# EAGLE design plansza_do_teleturnieju (EAGLE 9.6.2)
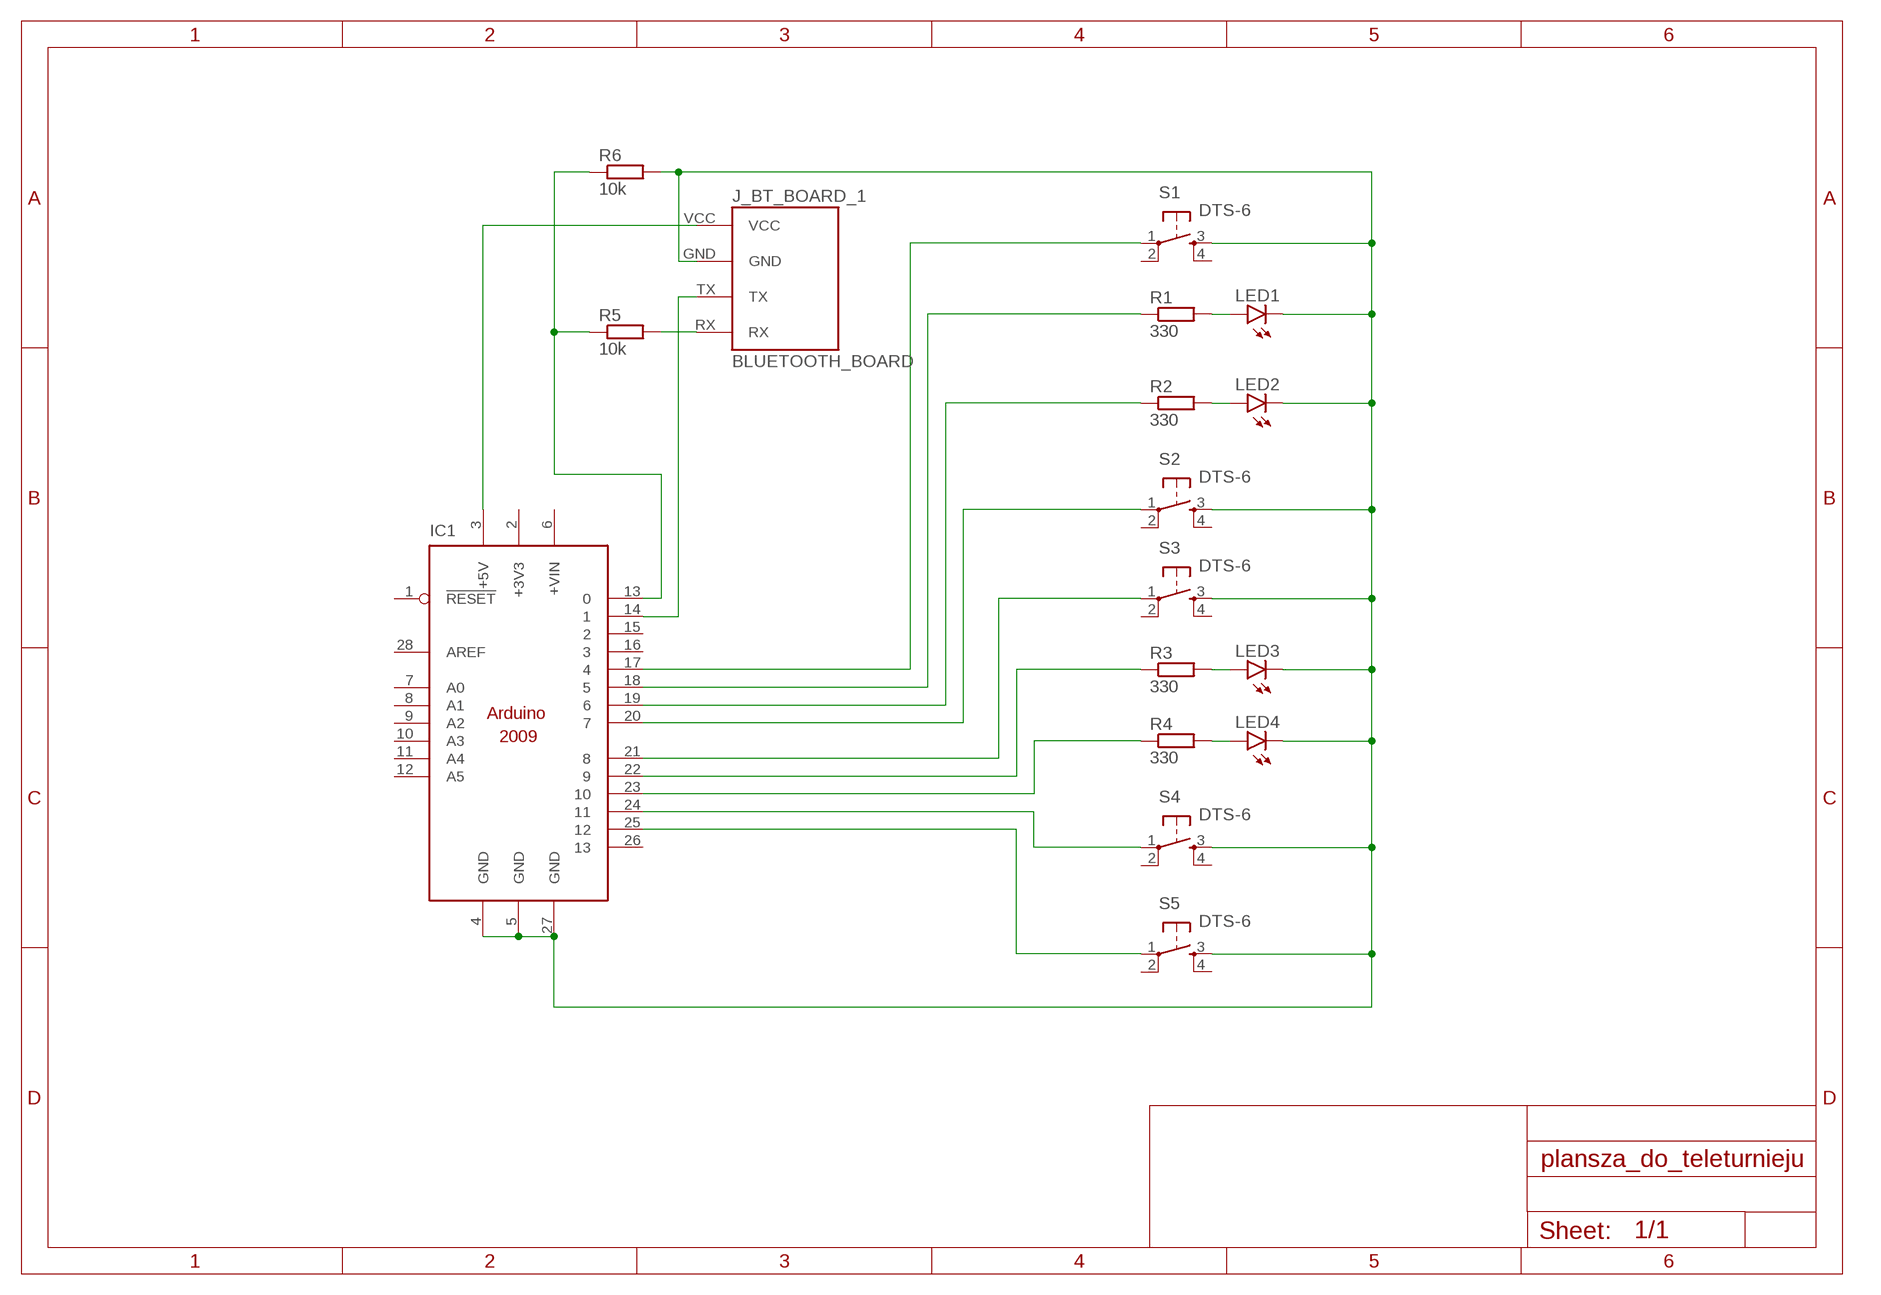
[diagram p0: schematic, sheet 1]

## Parts
IC1  ARDUINO2009_10  [ARDUINO2009]
J_BT_BOARD_1  BLUETOOTH_BOARD  [BT_BOARD_FOOTPRINT]
LED1  LEDLD260  [LD260]
LED2  LEDLD260  [LD260]
LED3  LEDLD260  [LD260]
LED4  LEDLD260  [LD260]
R1  330  R-EU_0204/7  [0204/7]
R2  330  R-EU_0204/7  [0204/7]
R3  330  R-EU_0204/7  [0204/7]
R4  330  R-EU_0204/7  [0204/7]
R5  10k  R-EU_0204/7  [0204/7]
R6  10k  R-EU_0204/7  [0204/7]
S1  DTS-6  [DTS-6]
S2  DTS-6  [DTS-6]
S3  DTS-6  [DTS-6]
S4  DTS-6  [DTS-6]
S5  DTS-6  [DTS-6]

## Nets
N$1: IC1.17 S1.1
N$2: IC1.18 R1.1
N$3: IC1.24 S4.1
N$4: IC1.23 R4.1
N$5: IC1.21 S3.1
N$6: IC1.22 R3.1
N$7: IC1.20 S2.1
N$8: IC1.19 R2.1
N$9: IC1.4(GND) IC1.5(GND) IC1.27(GND) J_BT_BOARD_1.GND LED1.K(C) LED2.K(C) LED3.K(C) LED4.K(C) R6.2 S1.3 S2.3 S3.3 S4.3 S5.3
N$10: IC1.25 S5.1
N$11: LED1.A R1.2
N$12: IC1.3(+5V) J_BT_BOARD_1.VCC
N$13: IC1.13 R5.1 R6.1
N$14: J_BT_BOARD_1.RX R5.2
N$15: LED2.A R2.2
N$16: LED3.A R3.2
N$17: LED4.A R4.2
N$18: IC1.14 J_BT_BOARD_1.TX
Unconnected: IC1.1(!RESET) IC1.6(+VIN) IC1.7(A0) IC1.8(A1) IC1.9(A2) IC1.10(A3) IC1.11(A4) IC1.12(A5) IC1.15 IC1.16 IC1.26 IC1.28(AREF) S1.2 S1.4 S2.2 S2.4 S3.2 S3.4 S4.2 S4.4 S5.2 S5.4

## Power pins joined to a net without a drawn wire
+3V3: IC1.2(+3V3)

## Library data of the parts
IC1 = jn:ARDUINO2009_1: The Arduino Duemilanove ("2009") is a microcontroller board based on the ATmega168 or ATmega328. - 14 digital input/output pins (of which 6 can be used as PWM outputs) - 6 analog inputs, a 16 MHz crystal oscillator - USB connection - power jack - ISP header - reset button It contains everything needed to support the microcontroller; simply connect it to a computer with a USB cable or power it with a AC-to-DC adapter or battery to get started http://arduino.cc/en/Main/ArduinoBoardDuemilanove
J_BT_BOARD_1 = jn:BLUETOOTH_BOARD: Bluetooth Board V1.05
LED1-LED4 = jn:LED: LED OSRAM: - CHIPLED LG R971, LG N971, LY N971, LG Q971, LY Q971, LO R971, LY R971 LH N974, LH R974 LS Q976, LO Q976, LY Q976 LO Q996 - Hyper CHIPLED LW Q18S LB Q993, LB Q99A, LB R99A - SideLED LS A670, LO A670, LY A670, LG A670, LP A670 LB A673, LV A673, LT A673, LW A673 LH A674 LY A675 LS A676, LA A676, LO A676, LY A676, LW A676 LS A679, LY A679, LG A679 - Hyper Micro SIDELED® LS Y876, LA Y876, LO Y876, LY Y876 LT Y87S - SmartLED LW L88C, LW L88S LB L89C, LB L89S, LG L890 LS L89K, LO L89K, LY L89K LS L896, LA L896, LO L896, LY L896 - TOPLED LS T670, LO T670, LY T670, LG T670, LP T670 LSG T670, LSP T670, LSY T670, LOP T670, LYG T670 LG T671, LOG T671, LSG T671 LB T673, LV T673, LT T673, LW T673 LH T674 LS T676, LA T676, LO T676, LY T676, LB T676, LH T676, LSB T676, LW T676 LB T67C, LV T67C, LT T67C, LS T67K, LO T67K, LY T67K, LW E67C LS E67B, LA E67B, LO E67B, LY E67B, LB E67C, LV E67C, LT E67C LW T67C LS T679, LY T679, LG T679 LS T770, LO T770, LY T770, LG T770, LP T770 LB T773, LV T773, LT T773, LW T773 LH T774 LS E675, LA E675, LY E675, LS T675 LS T776, LA T776, LO T776, LY T776, LB T776 LHGB T686 LT T68C, LB T68C - Hyper Mini TOPLED® LB M676 - Mini TOPLED Santana® LG M470 LS M47K, LO M47K, LY M47K Source: http://www.osram.convergy.de LUXEON: - LUMILED® LXK2-PW12-R00, LXK2-PW12-S00, LXK2-PW14-U00, LXK2-PW14-V00 LXK2-PM12-R00, LXK2-PM12-S00, LXK2-PM14-U00 LXK2-PE12-Q00, LXK2-PE12-R00, LXK2-PE12-S00, LXK2-PE14-T00, LXK2-PE14-U00 LXK2-PB12-K00, LXK2-PB12-L00, LXK2-PB12-M00, LXK2-PB14-N00, LXK2-PB14-P00, LXK2-PB14-Q00 LXK2-PR12-L00, LXK2-PR12-M00, LXK2-PR14-Q00, LXK2-PR14-R00 LXK2-PD12-Q00, LXK2-PD12-R00, LXK2-PD12-S00 LXK2-PH12-R00, LXK2-PH12-S00 LXK2-PL12-P00, LXK2-PL12-Q00, LXK2-PL12-R00 Source: www.luxeon.com KINGBRIGHT: KA-3528ASYC Source: www.kingbright.com
R1-R6 = jn:R-EU_: RESISTOR, European symbol
S1-S5 = jn:DTS-6

## Net classes
0 default: width 1.524 mm

## Board
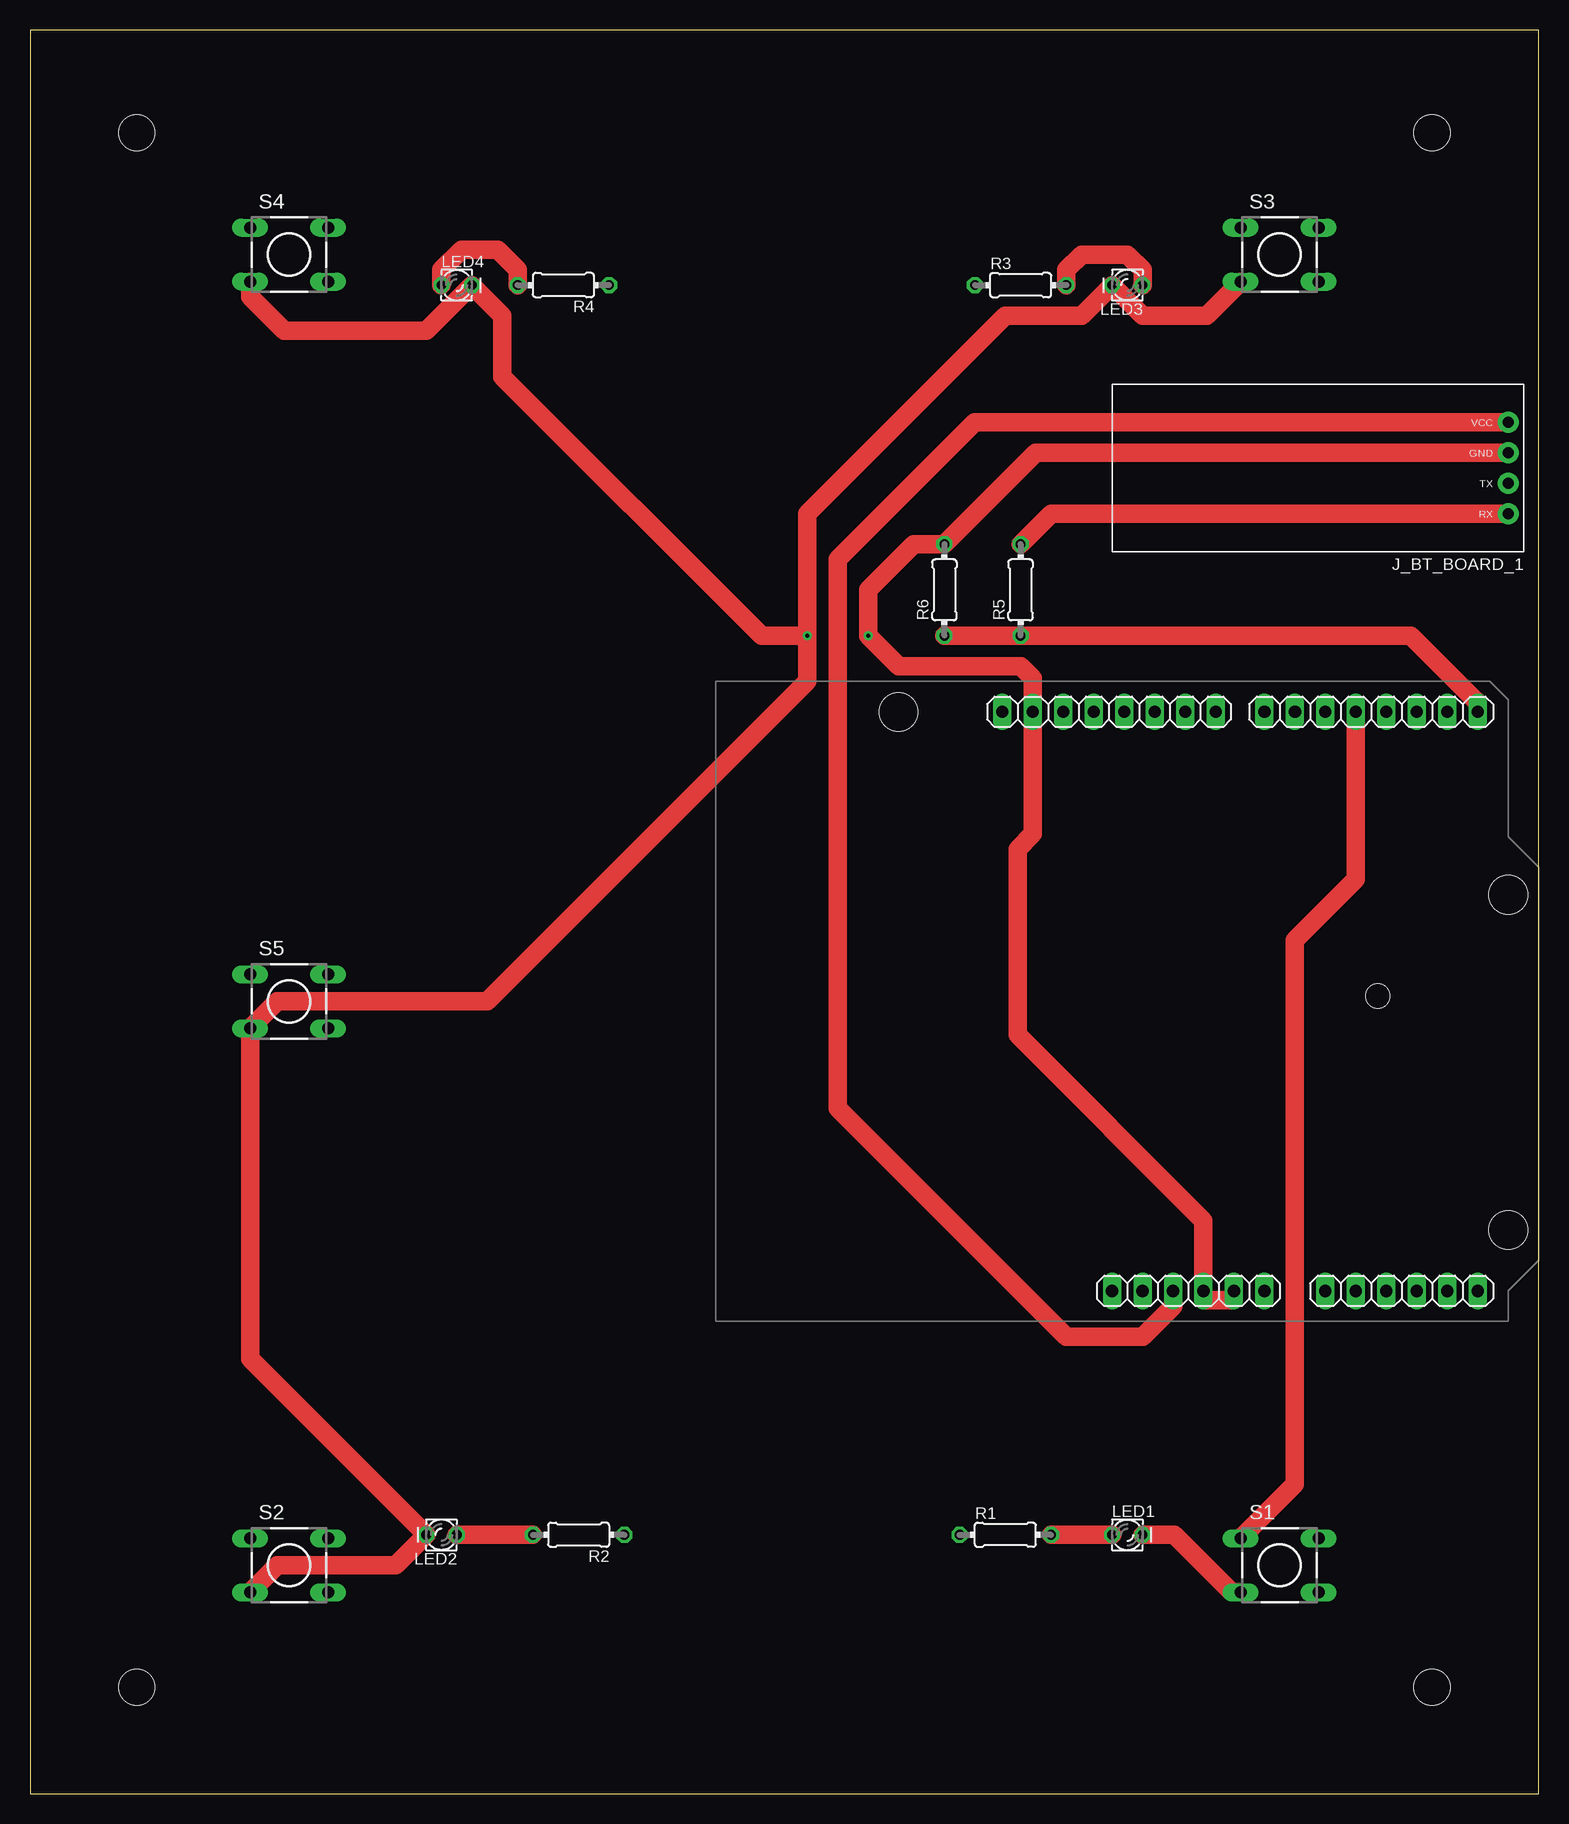
[diagram p1: board, top side]
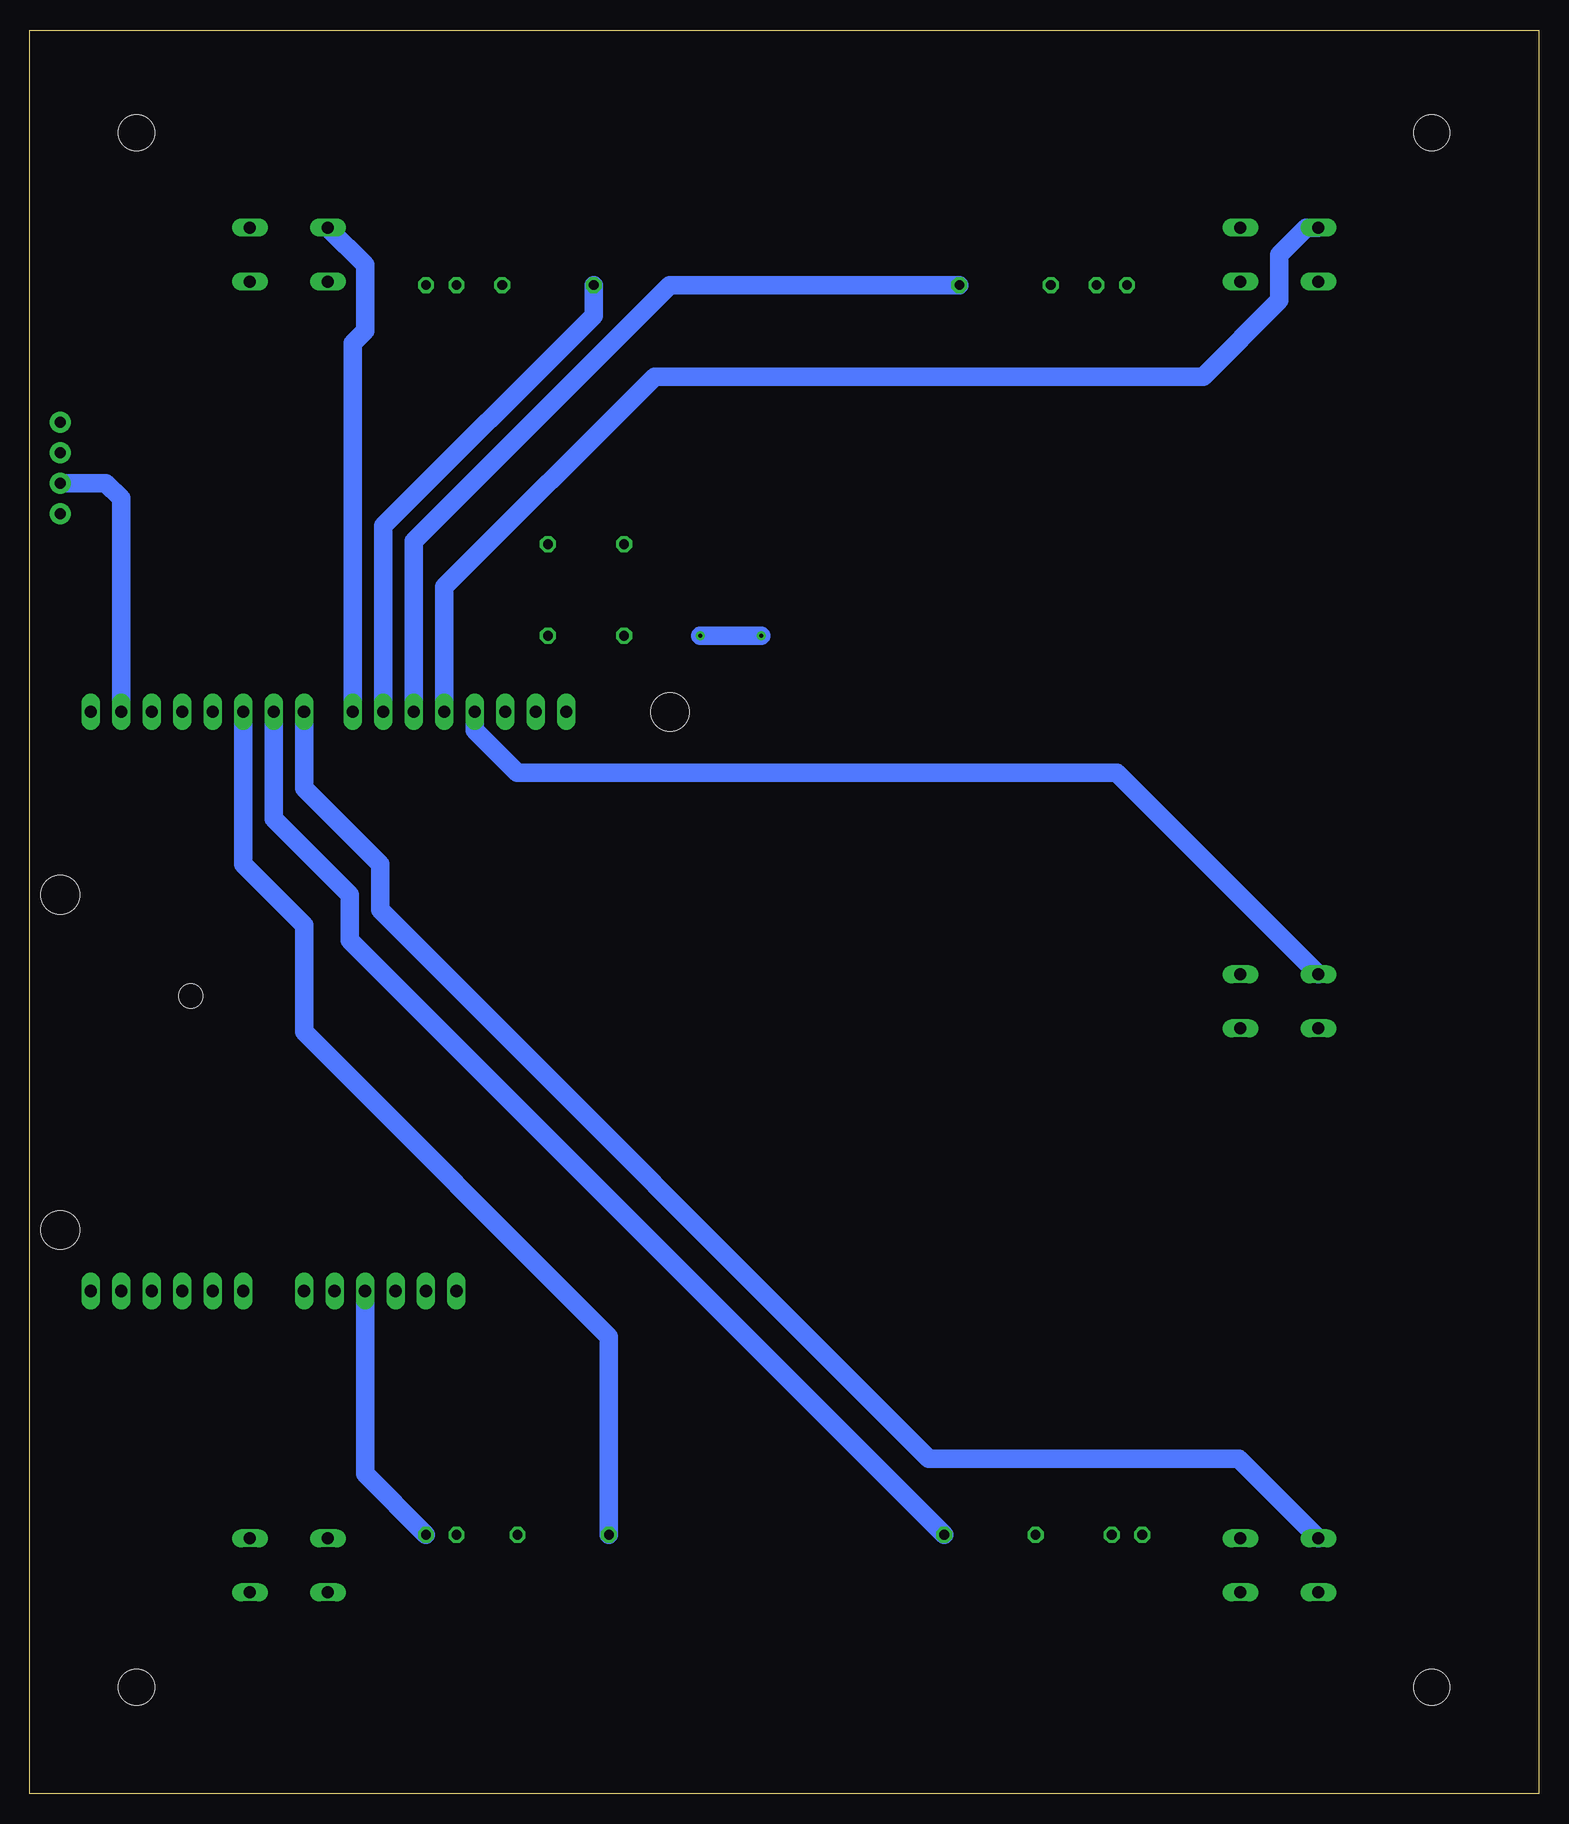
[diagram p2: board, bottom side, seen from below]

Size 125.71 x 146.99 mm. Coordinates in mm from the lower left corner, seen from the top.
Outline: 0,0 125.71,0 125.71,146.99 0,146.99 0,0
Copper layers (1*16): Top 0.035mm / dielectric 1.5mm / Bottom 0.035mm
Design rules "default": minimum track width 6mil, minimum drill 0.35mm, track to track 6mil, track to pad 6mil, pad to pad 6mil, via to via 6mil, smd to smd 6mil, copper to edge 40mil, drill to drill 6mil, minimum pad ring 10mil, minimum via ring 8mil, stop-mask expansion 4mil, vias tented up to drill 0mil, thermal gap 10mil
Holes 3 mm at 8.89,138.43 116.84,138.43 116.84,8.89 8.89,8.89

### Footprints (pad centres in the part's own frame; a part is rotated, then mirrored left to right if it is on the bottom)
ARDUINO2009 = drill 1.016 long: 1 33.02,2.54; 2 35.56,2.54; 3 38.1,2.54; 4 40.64,2.54; 5 43.18,2.54; 6 45.72,2.54; 7 50.8,2.54; 8 53.34,2.54; 9 55.88,2.54; 10 58.42,2.54; 11 60.96,2.54; 12 63.5,2.54; 13 63.5,50.8; 14 60.96,50.8; 15 58.42,50.8; 16 55.88,50.8; 17 53.34,50.8; 18 50.8,50.8; 19 48.26,50.8; 20 45.72,50.8; 21 41.656,50.8; 22 39.116,50.8; 23 36.576,50.8; 24 34.036,50.8; 25 31.496,50.8; 26 28.956,50.8; 27 26.416,50.8; 28 23.876,50.8 | hole 3.2: 15.24,50.8; 66.04,35.56; 66.04,7.62 | hole 2: 55.17,27.114
BT_BOARD_FOOTPRINT = drill 0.9 pad 1.778: GND -16.51,-1.27; RX -16.51,3.81; TX -16.51,1.27; VCC -16.51,-3.81
LD260 = drill 0.813 octagon: A -1.27,0; K 1.27,0
0204/7 = drill 0.813 octagon: 1 -3.81,0; 2 3.81,0
DTS-6 = drill 1 long: 1 -3.25,2.25; 2 3.25,2.25; 3 -3.25,-2.25; 4 3.25,-2.25

### Placement (x,y rotation side)
IC1  57.15,39.37 0 top
J_BT_BOARD_1  106.68,110.49 180 top
LED1  91.44,21.59 0 top
LED2  34.29,21.59 180 top
LED3  91.44,125.73 180 top
LED4  35.56,125.73 0 top
R1  81.28,21.59 0 top
R2  45.72,21.59 180 top
R3  82.55,125.73 0 top
R4  44.45,125.73 180 top
R5  82.55,100.33 90 top
R6  76.2,100.33 90 top
S1  104.14,19.05 0 top
S2  21.59,19.05 0 top
S3  104.14,128.27 0 top
S4  21.59,128.27 0 top
S5  21.59,66.04 0 top

### Tracks (layer width: path | path; a pad name or v marks a point on that pad's centre or on a via)
N$1
  Top 1.524: S1.1 105.41,25.82 105.41,71.12 110.49,76.2 IC1.17
N$2
  Bottom 1.524: R1.1 77.47,38.1 102.87,63.5 102.87,72.39 107.95,77.47 IC1.18
N$3
  Bottom 1.524: IC1.24 91.19,100.58 73.66,118.11 27.94,118.11 21.59,124.46 21.59,128.27 19.34,130.52 S4.1
N$4
  Bottom 1.524: IC1.23 93.73,104.39 72.39,125.73 R4.1
N$5
  Bottom 1.524: S3.1 97.79,127.42 97.79,127 97.79,121.92 98.81,120.9 IC1.21
N$6
  Bottom 1.524: IC1.22 96.27,105.66 78.74,123.19 R3.1
N$7
  Bottom 1.524: S2.1 24.98,27.94 50.8,27.94 96.52,73.66 96.52,77.47 102.87,83.82 IC1.20
N$8
  Bottom 1.524: R2.1 99.06,71.12 99.06,74.93 105.41,81.28 IC1.19
N$9  (via drill 0.35)
  Top 1.524: J_BT_BOARD_1.GND 83.82,111.76 R6.2 73.66,104.14 69.85,100.33 v69.85,96.52 72.39,93.98 82.55,93.98 83.57,92.96 IC1.27 83.57,80.01 82.3,78.74 82.3,63.25 97.79,47.75 IC1.4 97.79,41.15 100.33,41.15 IC1.5 | v64.77,96.52 64.77,106.68 81.28,123.19 87.63,123.19 LED3.K 92.71,123.19 98.06,123.19 S3.3 | v64.77,96.52 60.96,96.52 39.37,118.11 39.37,123.19 LED4.K 33.02,121.92 21.17,121.92 18.34,124.75 S4.3 | LED1.K 95.35,21.59 100.14,16.8 S1.3 | v64.77,96.52 64.77,92.71 38.1,66.04 20.59,66.04 S5.3 18.34,36.27 LED2.K 30.48,19.05 20.59,19.05 S2.3
  Bottom 1.524: v69.85,96.52 v64.77,96.52 | IC1.4 97.79,26.67 LED1.K
N$10
  Bottom 1.524: S5.1 35.14,85.09 85.09,85.09 88.65,88.65 IC1.25
N$11
  Top 1.524: LED1.A R1.2
N$12
  Top 1.524: J_BT_BOARD_1.VCC 78.74,114.3 67.31,102.87 67.31,57.15 86.36,38.1 92.71,38.1 95.25,40.64 IC1.3
N$13
  Top 1.524: IC1.13 120.65,90.93 115.06,96.52 R5.1 R6.1
N$14
  Top 1.524: J_BT_BOARD_1.RX 85.09,106.68 R5.2
N$15
  Top 1.524: R2.2 LED2.A
N$16
  Top 1.524: LED3.A 92.71,127 91.44,128.27 87.63,128.27 86.36,127 R3.2
N$17
  Top 1.524: LED4.A 34.29,127 35.97,128.68 38.96,128.68 40.64,127 R4.2
N$18
  Bottom 1.524: IC1.14 118.11,107.95 119.38,109.22 J_BT_BOARD_1.TX